# Altium project diploma.PrjPcb
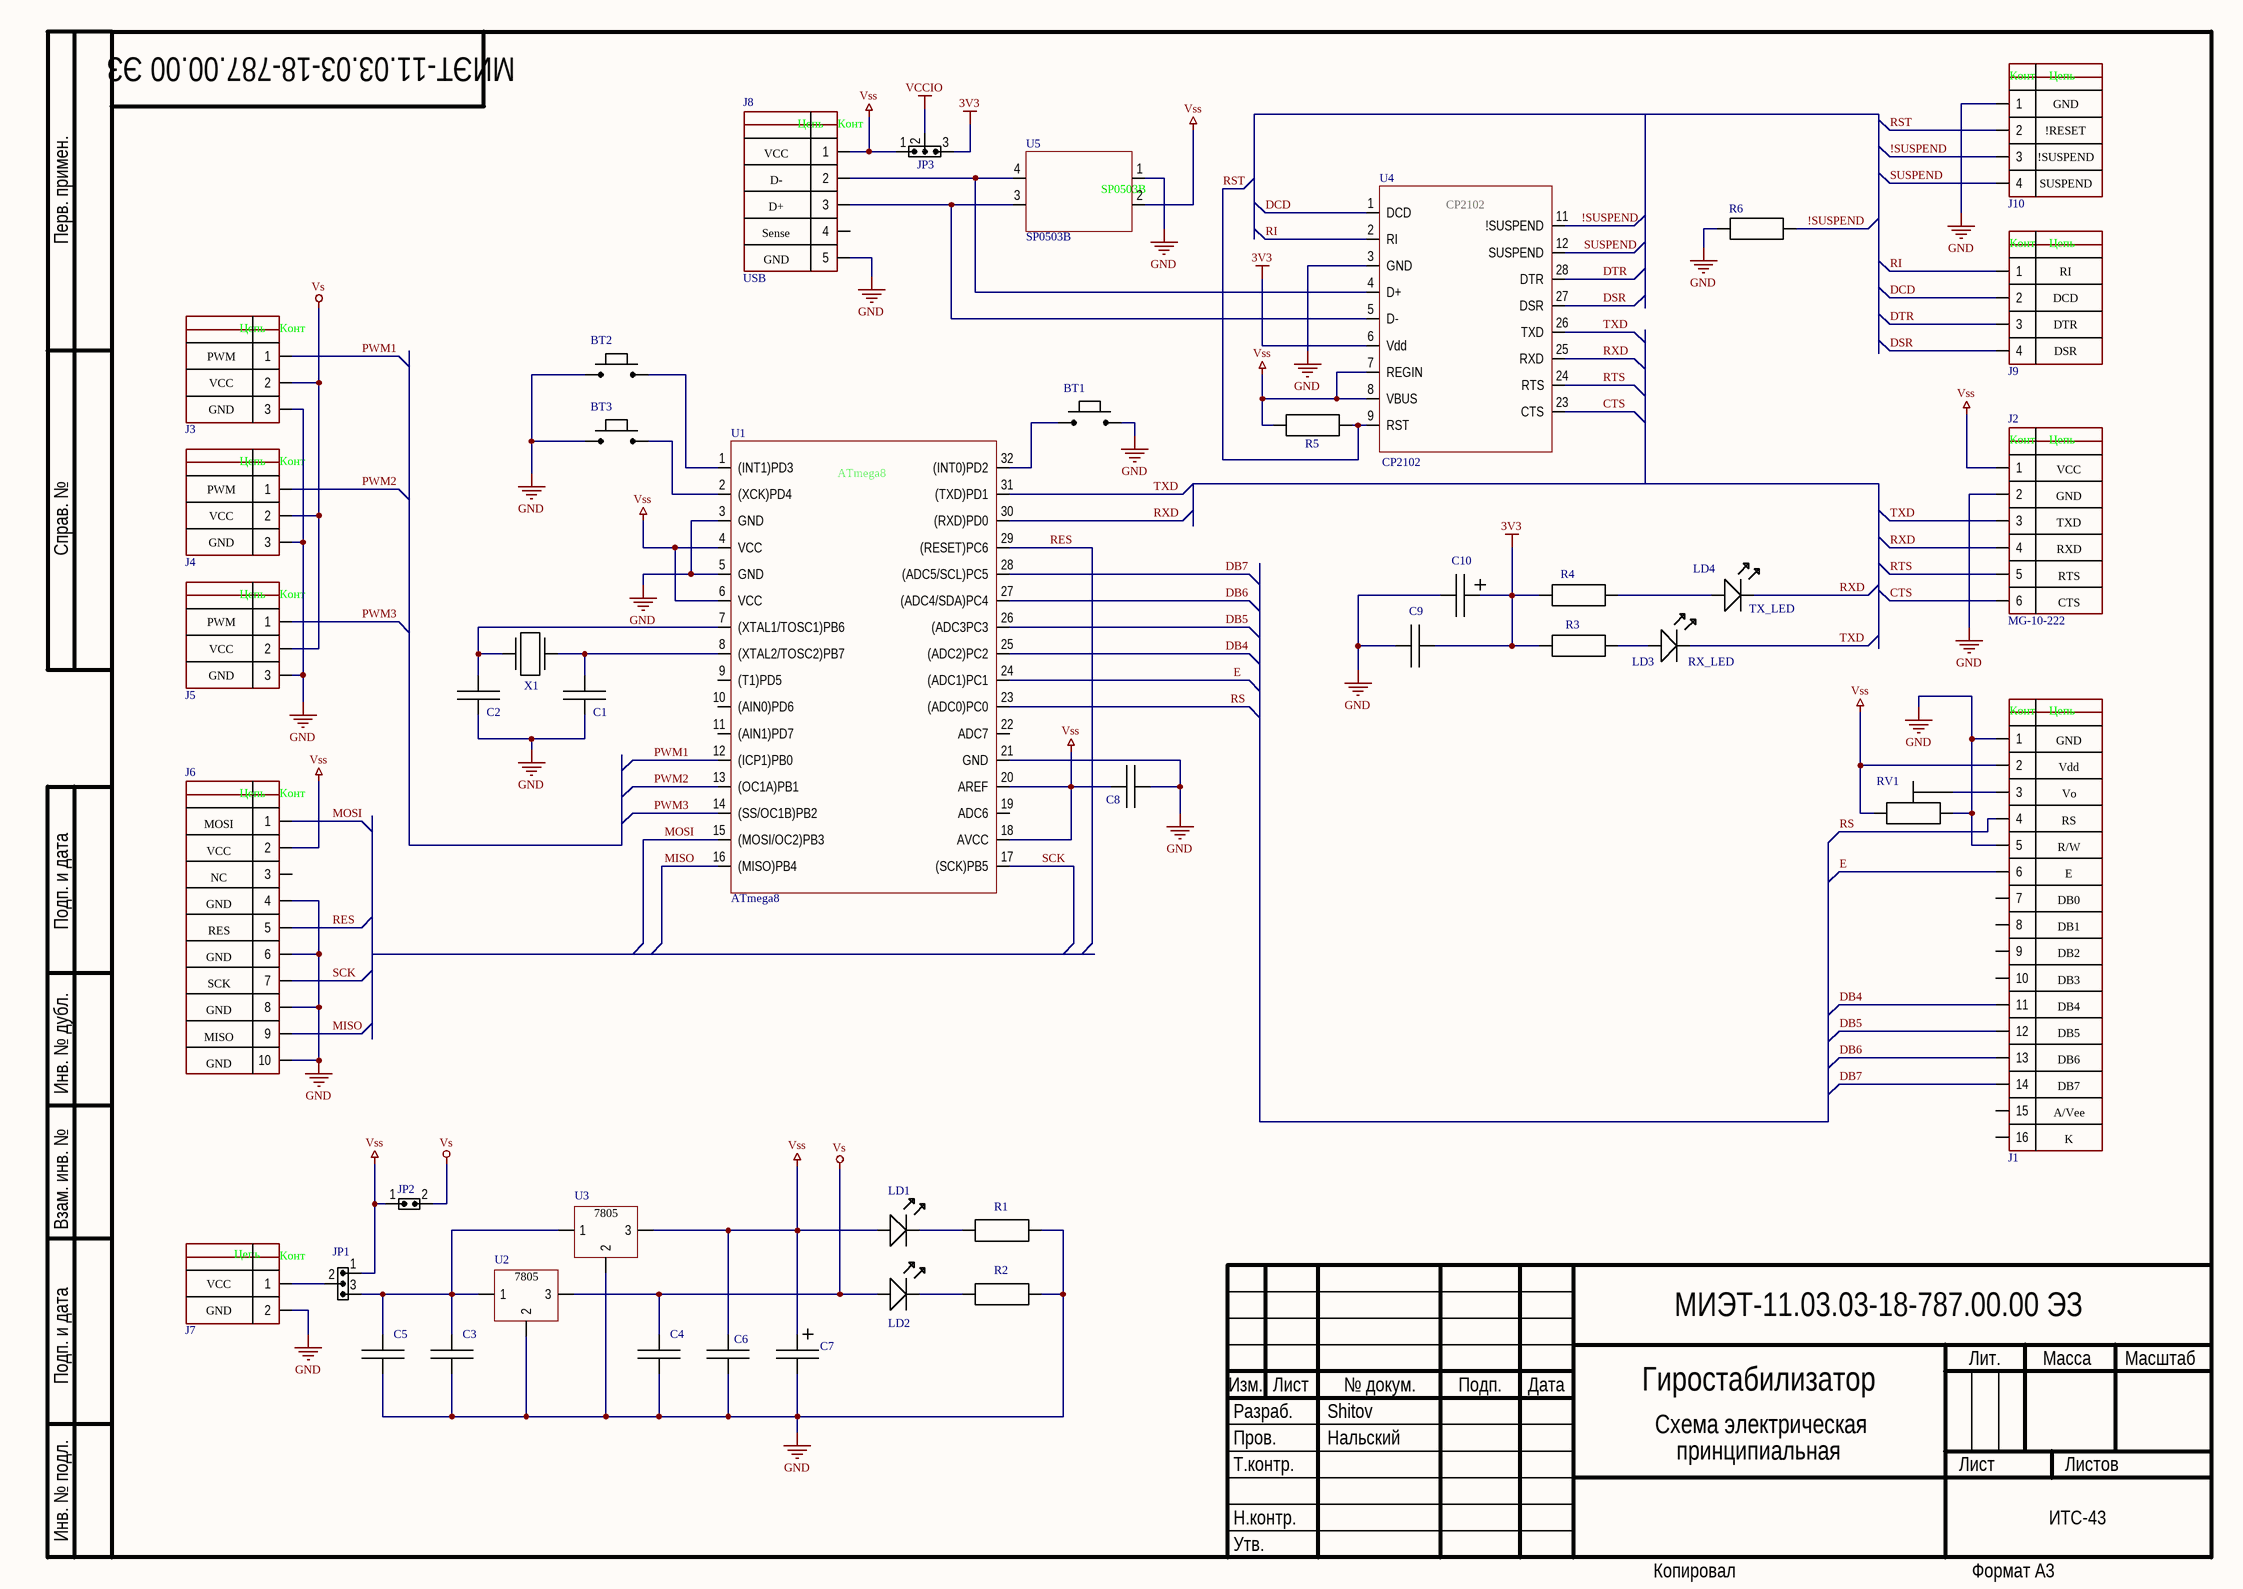
[diagram p0: Scheme.SchDoc]
1 sheet, 43 parts. Net scope: global (net labels, ports and power ports of the same name join across sheets).
Board files: PCB2.PcbDoc, PCB1.PcbDoc, Board.PcbDoc

## Sheet Scheme.SchDoc
size 420 x 297 mm; CheckedBy: Нальский; Author: Шитов; Scale: 1:1; Разраб.: Shitov; Обозначение документа: МИЭТ-11.03.03-18-787.00.00 ЭЗ; Пров.: Нальский; Наименование организации: ИТС-43; Наименование изделия 1: Гиростабилизатор; Наименование изделия 2: Схема электрическая; Наименование изделия 3: принципиальная; Rule: PcbType=ProtelPcb; Rule: PcbType=ProtelPcb

### Parts
BT1  Button  [Button 5x5]  (value not drawn)
BT2  Button  [Button 5x5]  (value not drawn)
BT3  Button  [Button 5x5]  (value not drawn)
C1  С0805  [0805]  (value not drawn)
C2  С0805  [0805]  (value not drawn)
C3  С0805  [0805]  (value not drawn)
C4  С0805  [0805]  (value not drawn)
C5  С0805  [0805]  (value not drawn)
C6  С0805  [0805]  (value not drawn)
C7  С3/4  [A]  (value not drawn)
C8  С0805  [0805]  (value not drawn)
C9  С0805  [0805]  (value not drawn)
C10  С3/4  [A]  (value not drawn)
J1  LCD  [LCD]  (value not drawn)
J2  MG-10-222  [DS1022 1x6]
J3  Servo  [DS1022 1x3]  (value not drawn)
J4  Servo  [DS1022 1x3]  (value not drawn)
J5  Servo  [DS1022 1x3]  (value not drawn)
J6  Вилка ВН-10  [Вилка ВН-10]  (value not drawn)
J7  Input power  [Input power]  (value not drawn)
J8  USB  [micro-USB]
J9  Other header  [Other header]  (value not drawn)
J10  Other header 2  [Other header]  (value not drawn)
JP1  Jumper 3  [JUMPER 3]  (value not drawn)
JP2  Jumper  [Jumper]  (value not drawn)
JP3  Jumper 3  [JUMPER 3]  (value not drawn)
LD1  LED  [LED]  (value not drawn)
LD2  LED  [LED]  (value not drawn)
LD3  RX_LED  [LED]
LD4  TX_LED  [LED]
R1  R0805  [0805]  (value not drawn)
R2  R0805  [0805]  (value not drawn)
R3  R0805  [0805]  (value not drawn)
R4  R0805  [0805]  (value not drawn)
R5  R0805  [0805]  (value not drawn)
R6  R0805  [0805]  (value not drawn)
RV1  POT  [POT]  (value not drawn)
U1  ATmega8  [ATmega8]
U2  7805 SMD  [7805 SMD]  (value not drawn)
U3  7805 SMD  [7805 SMD]  (value not drawn)
U4  CP2102  [CP2102]
U5  SP0503B  [SP0503B]
X1  XTAL  [HC-49SM]  (value not drawn)

### Nets
3V3: C9.2 C10.1 JP3.3 R3.1 R4.1 U4.6(Vdd)
GND: BT1.2 BT2.1 BT3.1 C1.1 C2.1 C3.1 C4.1 C5.1 C6.1 C7.2 C8.2 C9.1 C10.2 J1.1 J1.5 J2.2 J3.3 J4.3 J5.3 J6.4 J6.6 J6.8 J6.10 J7.2 J8.5 J10.1 R1.2 R2.2 R6.1 RV1.3 U1.3(GND) U1.5(GND) U1.21(GND) U2.2 U3.2 U4.3(GND) U5.1
VCCIO: JP3.2
Vs: C4.2 J3.2 J4.2 J5.2 JP2.2 LD2.1 U2.3
Vss: C6.2 C7.1 C8.1 J1.2 J2.1 J6.2 J8.1 JP1.1 JP2.1 JP3.1 LD1.1 R5.1 RV1.1 U1.4(VCC) U1.6(VCC) U1.18(AVCC) U1.20(AREF) U3.3 U4.7(REGIN) U4.8(VBUS) U5.2
!SUSPEND: J10.3 R6.2 U4.11(!SUSPEND)
CTS: J2.6 U4.23(CTS)
DB4: J1.11 U1.25((ADC2)PC2)
DB5: J1.12 U1.26((ADC3PC3)
DB6: J1.13 U1.27((ADC4/SDA)PC4)
DB7: J1.14 U1.28((ADC5/SCL)PC5)
DCD: J9.2 U4.1(DCD)
DSR: J9.4 U4.27(DSR)
DTR: J9.3 U4.28(DTR)
E: J1.6 U1.24((ADC1)PC1)
MISO: J6.9 U1.16((MISO)PB4)
MOSI: J6.1 U1.15((MOSI/OC2)PB3)
PWM1: J3.1 U1.12((ICP1)PB0)
PWM2: J4.1 U1.13((OC1A)PB1)
PWM3: J5.1 U1.14((SS/OC1B)PB2)
RES: J6.5 U1.29((RESET)PC6)
RI: J9.1 U4.2(RI)
RS: J1.4 U1.23((ADC0)PC0)
RST: J10.2 R5.2 U4.9(RST)
RTS: J2.5 U4.24(RTS)
RXD: J2.4 LD4.2 U1.30((RXD)PD0) U4.25(RXD)
SCK: J6.7 U1.17((SCK)PB5)
SUSPEND: J10.4 U4.12(SUSPEND)
TXD: J2.3 LD3.2 U1.31((TXD)PD1) U4.26(TXD)
NetBT1_1: BT1.1 U1.32((INT0)PD2)
NetBT2_2: BT2.2 U1.1((INT1)PD3)
NetBT3_2: BT3.2 U1.2((XCK)PD4)
NetC1_2: C1.2 U1.8((XTAL2/TOSC2)PB7) X1.2
NetC2_2: C2.2 U1.7((XTAL1/TOSC1)PB6) X1.1
NetC3_2: C3.2 C5.2 JP1.3 U2.1 U3.1
NetJ1_3: J1.3 RV1.2
NetJ7_1: J7.1 JP1.2
NetJ8_2: J8.2 U4.4(D+) U5.4
NetJ8_3: J8.3 U4.5(D-) U5.3
NetLD1_2: LD1.2 R1.1
NetLD2_2: LD2.2 R2.1
NetLD3_1: LD3.1 R3.2
NetLD4_1: LD4.1 R4.2

Not connected (* = marked no-connect by the designer): J1 7 8 9 10 15 16; J6 3; J8 4; U1 9((T1)PD5) 10((AIN0)PD6) 11((AIN1)PD7) 19(ADC6) 22(ADC7)

### Notes on the sheet
- Перв. примен.
- Справ. №
- Подп. и дата
- Инв. № дубл.
- Взам. инв. №
- Разраб.
- Изм.
- Лист
- № докум.
- Подп.
- Дата
- Лит.
- Масса
- Масштаб
- Пров.
- Т.контр.
- Листов
- Инв. № подл.
- Утв.
- Н.контр.
- Копировал
- Формат А3
- (in symbol 7805 SMD) 7805
- (in symbol Input power) Цепь; Конт; VCC; GND
- (in symbol LCD) Конт; Цепь; GND; Vdd; Vo; RS; R/W; E; DB0; DB1; DB2; DB3; DB4; DB5; DB6; DB7; A/Vee; K
- (in symbol MG-10-222) Конт; Цепь; VCC; GND; TXD; RXD; RTS; CTS
- (in symbol Other header) Конт; Цепь; RI; DCD; DTR; DSR
- (in symbol Other header 2) Конт; Цепь; GND; !RESET; !SUSPEND; SUSPEND
- (in symbol Servo) Цепь; Конт; PWM; VCC; GND
- (in symbol USB) Цепь; Конт; VCC; D-; D+; Sense; GND
- (in symbol Вилка ВН-10) Цепь; Конт; MOSI; VCC; NC; GND; RES; SCK; MISO

### Library data of the parts
LD3 LD4 = LED
U5 = SP0503B: TO-253